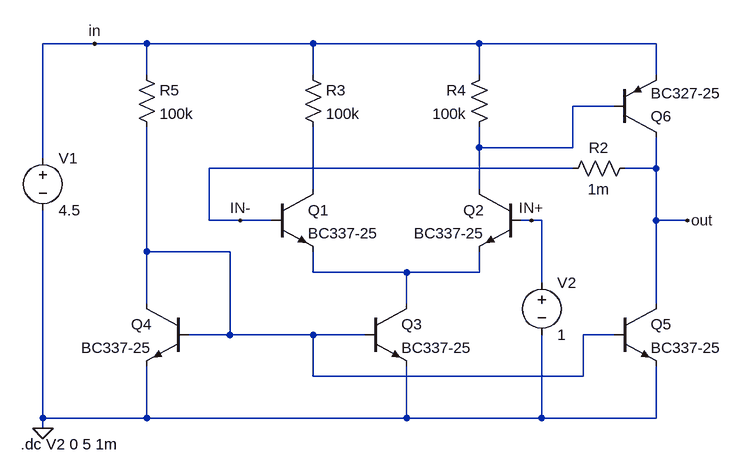
[diagram p0: schematic Differential_OPAmp.asc]
Differential_OPAmp.asc, the LTspice schematic file:
Version 4
SHEET 1 1100 680
WIRE 96 48 16 48
WIRE 176 48 96 48
WIRE 432 48 176 48
WIRE 688 48 432 48
WIRE 960 48 688 48
WIRE 176 96 176 48
WIRE 432 96 432 48
WIRE 688 96 688 48
WIRE 960 96 960 48
WIRE 896 144 832 144
WIRE 688 208 688 176
WIRE 832 208 832 144
WIRE 832 208 688 208
WIRE 16 224 16 48
WIRE 832 240 272 240
WIRE 960 240 960 192
WIRE 960 240 912 240
WIRE 432 272 432 176
WIRE 688 272 688 208
WIRE 272 320 272 240
WIRE 320 320 272 320
WIRE 368 320 320 320
WIRE 768 320 752 320
WIRE 784 320 768 320
WIRE 960 320 960 240
WIRE 1008 320 960 320
WIRE 176 368 176 176
WIRE 304 368 176 368
WIRE 432 400 432 368
WIRE 576 400 432 400
WIRE 688 400 688 368
WIRE 688 400 576 400
WIRE 784 416 784 320
WIRE 176 448 176 368
WIRE 576 448 576 400
WIRE 960 448 960 320
WIRE 304 496 304 368
WIRE 304 496 240 496
WIRE 432 496 304 496
WIRE 512 496 432 496
WIRE 896 496 848 496
WIRE 432 560 432 496
WIRE 848 560 848 496
WIRE 848 560 432 560
WIRE 16 624 16 304
WIRE 176 624 176 544
WIRE 176 624 16 624
WIRE 576 624 576 544
WIRE 576 624 176 624
WIRE 784 624 784 496
WIRE 784 624 576 624
WIRE 960 624 960 544
WIRE 960 624 784 624
WIRE 16 640 16 624
FLAG 16 640 0
FLAG 320 320 IN-
FLAG 1008 320 out
FLAG 96 48 in
FLAG 768 320 IN+
SYMBOL voltage 16 208 R0
WINDOW 123 0 0 Left 0
WINDOW 39 0 0 Left 0
SYMATTR InstName V1
SYMATTR Value 4.5
SYMBOL npn 368 272 R0
SYMATTR InstName Q1
SYMATTR Value BC337-25
SYMBOL npn 752 272 M0
SYMATTR InstName Q2
SYMATTR Value BC337-25
SYMBOL res 416 80 R0
SYMATTR InstName R3
SYMATTR Value 100k
SYMBOL res 704 80 M0
SYMATTR InstName R4
SYMATTR Value 100k
SYMBOL npn 512 448 R0
SYMATTR InstName Q3
SYMATTR Value BC337-25
SYMBOL npn 240 448 M0
SYMATTR InstName Q4
SYMATTR Value BC337-25
SYMBOL res 160 80 R0
SYMATTR InstName R5
SYMATTR Value 100k
SYMBOL npn 896 448 R0
SYMATTR InstName Q5
SYMATTR Value BC337-25
SYMBOL pnp 896 192 M180
SYMATTR InstName Q6
SYMATTR Value BC327-25
SYMBOL res 928 224 R90
WINDOW 0 0 56 VBottom 2
WINDOW 3 32 56 VTop 2
SYMATTR InstName R2
SYMATTR Value 1m
SYMBOL voltage 784 400 R0
WINDOW 123 0 0 Left 0
WINDOW 39 0 0 Left 0
SYMATTR InstName V2
SYMATTR Value 1
TEXT -18 664 Left 2 !.dc V2 0 5 1m

The netlist it stands for:
* Differential_OPAmp.asc
V1 in 0 4.5
Q1 N002 IN- N004 0 BC337-25
Q2 N001 IN+ N004 0 BC337-25
R3 in N002 100k
R4 in N001 100k
Q3 N004 N003 0 0 BC337-25
Q4 N003 N003 0 0 BC337-25
R5 in N003 100k
Q5 out N003 0 0 BC337-25
Q6 out N001 in 0 BC327-25
R2 out IN- 1m
V2 IN+ 0 1
.model NPN NPN
.model PNP PNP
.lib standard.bjt
.dc V2 0 5 1m
.backanno
.end